# Altium schematic sheet EEGV4.0.SchDoc
size A2
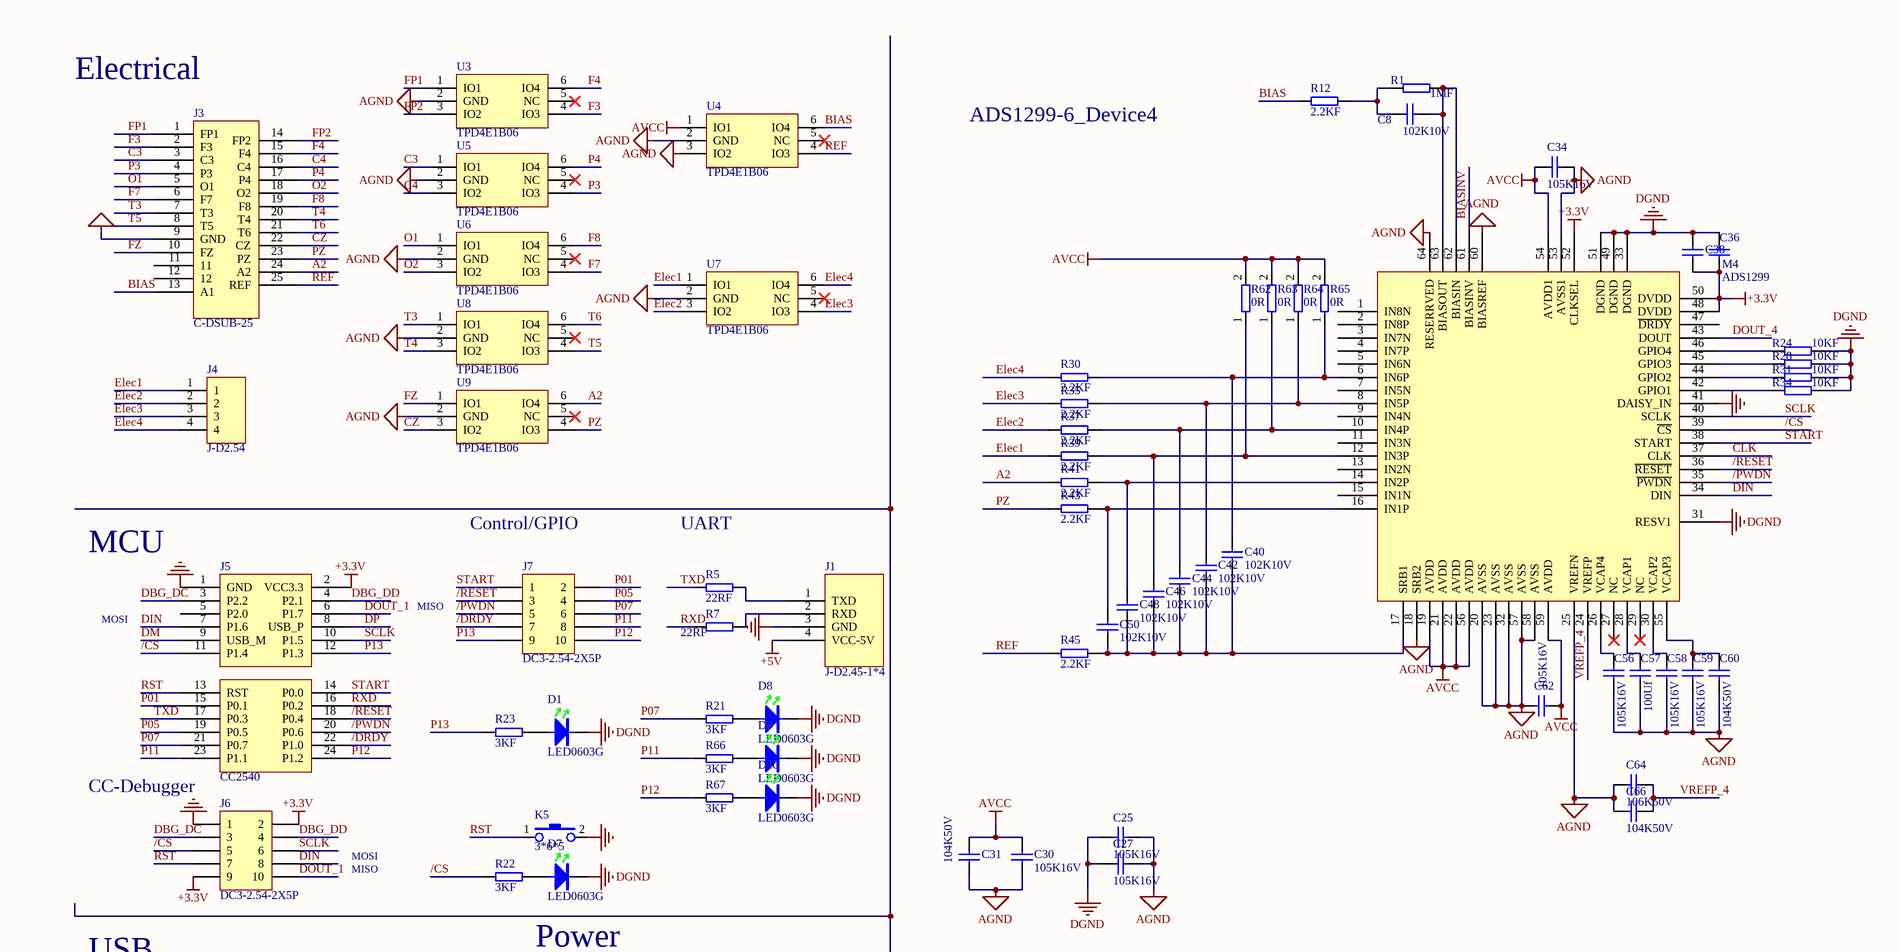
[diagram p0: EEGV4.0.SchDoc, top left]
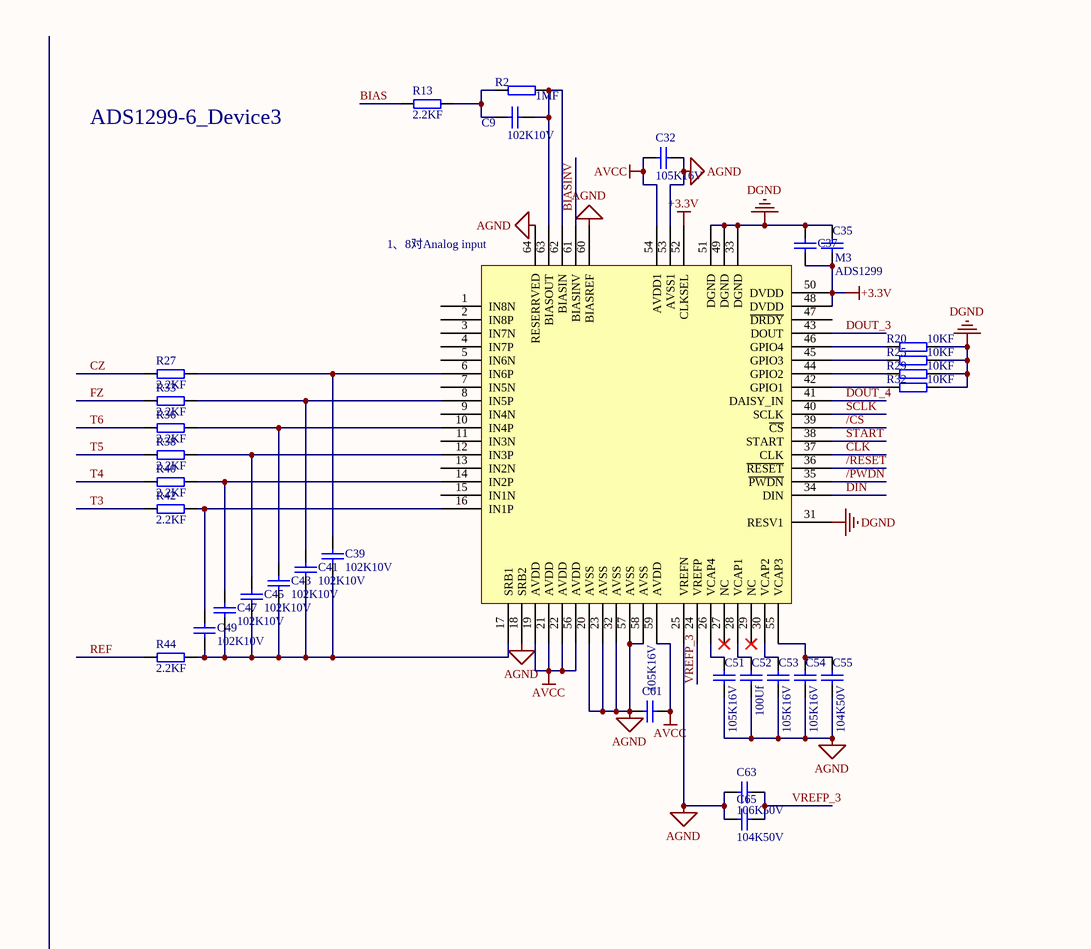
[diagram p1: EEGV4.0.SchDoc, top right]
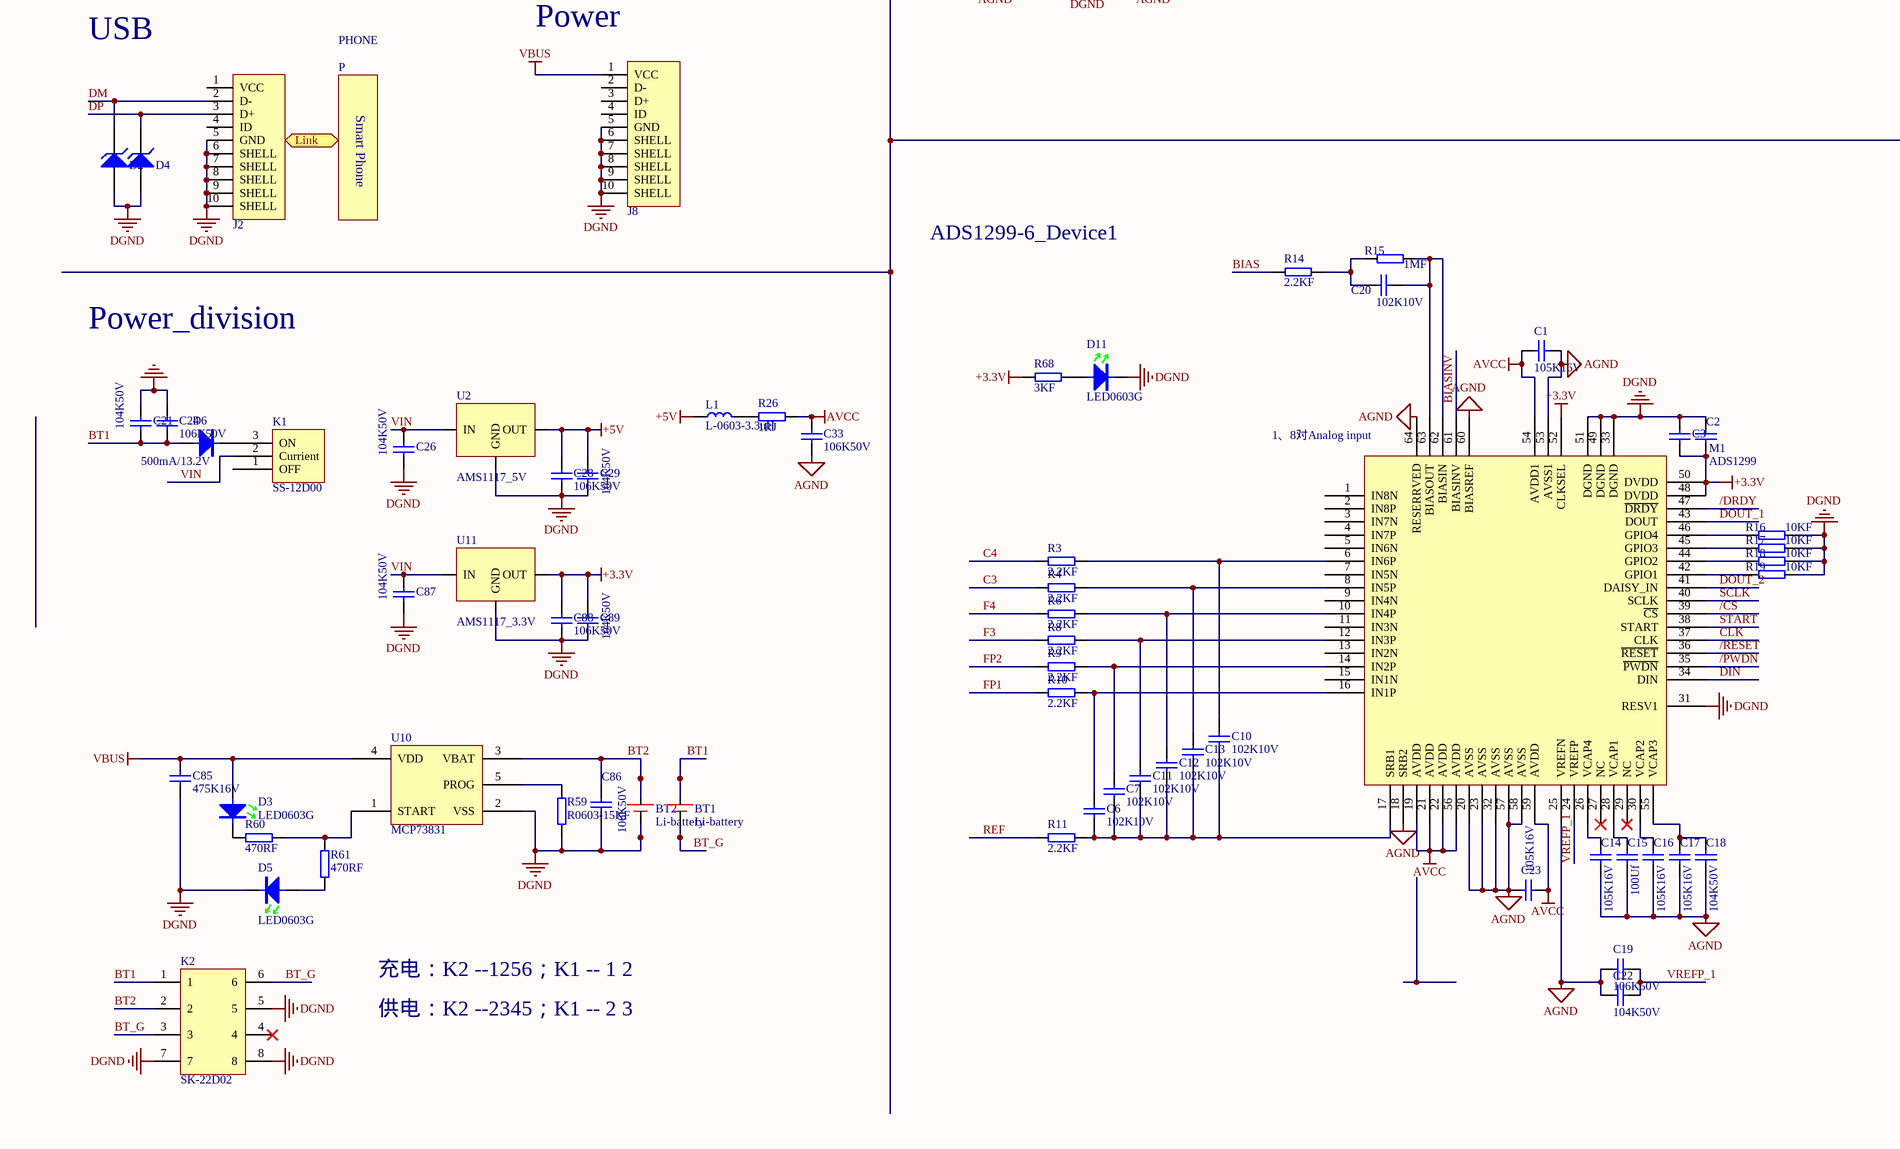
[diagram p2: EEGV4.0.SchDoc, bottom left]
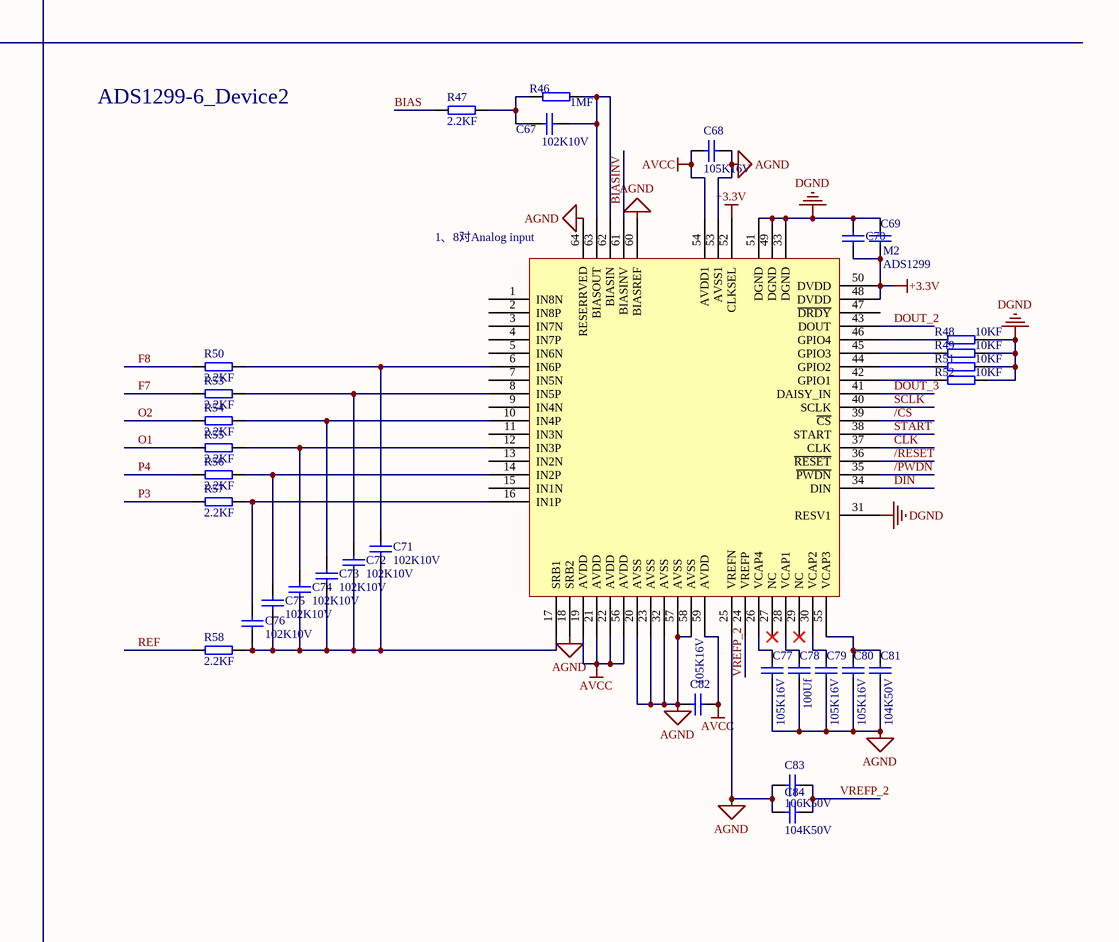
[diagram p3: EEGV4.0.SchDoc, bottom right]

## Parts
BT1  Li-battery  [LIR2032]
BT2  Li-battery  [LIR2032]
C1  105K16V  [C0603]
C2  104K50V  [C0603]  (value not drawn)
C3  105K16V  [C0603]  (value not drawn)
C6  102K10V  [C0603]
C7  102K10V  [C0603]
C8  102K10V  [C0603]
C9  102K10V  [C0603]
C10  102K10V  [C0603]
C11  102K10V  [C0603]
C12  102K10V  [C0603]
C13  102K10V  [C0603]
C14  105K16V  [C0603]
C15  100Uf  [C1210]
C16  105K16V  [C0603]
C17  105K16V  [C0603]
C18  104K50V  [C0603]
C19  106K50V  [C0603]
C20  102K10V  [C0603]
C21  104K50V  [C0603]
C22  104K50V  [C0603]
C23  105K16V  [C0603]
C24  106K50V  [C0603]
C25  105K16V  [C0603]
C26  104K50V  [C0603]
C27  105K16V  [C0603]
C28  106K50V  [C0603]
C29  104K50V  [C0603]
C30  105K16V  [C0603]
C31  104K50V  [C0603]
C32  105K16V  [C0603]
C33  106K50V  [C0603]
C34  105K16V  [C0603]
C35  104K50V  [C0603]  (value not drawn)
C36  104K50V  [C0603]  (value not drawn)
C37  105K16V  [C0603]  (value not drawn)
C38  105K16V  [C0603]  (value not drawn)
C39  102K10V  [C0603]
C40  102K10V  [C0603]
C41  102K10V  [C0603]
C42  102K10V  [C0603]
C43  102K10V  [C0603]
C44  102K10V  [C0603]
C45  102K10V  [C0603]
C46  102K10V  [C0603]
C47  102K10V  [C0603]
C48  102K10V  [C0603]
C49  102K10V  [C0603]
C50  102K10V  [C0603]
C51  105K16V  [C0603]
C52  100Uf  [C1210]
C53  105K16V  [C0603]
C54  105K16V  [C0603]
C55  104K50V  [C0603]
C56  105K16V  [C0603]
C57  100Uf  [C1210]
C58  105K16V  [C0603]
C59  105K16V  [C0603]
C60  104K50V  [C0603]
C61  105K16V  [C0603]
C62  105K16V  [C0603]
C63  106K50V  [C0603]
C64  106K50V  [C0603]
C65  104K50V  [C0603]
C66  104K50V  [C0603]
C67  102K10V  [C0603]
C68  105K16V  [C0603]
C69  104K50V  [C0603]  (value not drawn)
C70  105K16V  [C0603]  (value not drawn)
C71  102K10V  [C0603]
C72  102K10V  [C0603]
C73  102K10V  [C0603]
C74  102K10V  [C0603]
C75  102K10V  [C0603]
C76  102K10V  [C0603]
C77  105K16V  [C0603]
C78  100Uf  [C1210]
C79  105K16V  [C0603]
C80  105K16V  [C0603]
C81  104K50V  [C0603]
C82  105K16V  [C0603]
C83  106K50V  [C0603]
C84  104K50V  [C0603]
C85  475K16V  [C0603]
C86  106K50V  [C0603]
C87  104K50V  [C0603]
C88  106K50V  [C0603]
C89  104K50V  [C0603]
D1  LED0603G  [D-LED0603G]
D2  ESDA_TR1/0603  [HS_0603D]  (value not drawn)
D3  LED0603G  [D-LED0603G]
D4  ESDA_TR1/0603  [HS_0603D]  (value not drawn)
D5  LED0603G  [D-LED0603G]
D6  500mA/13.2V  [D1206]
D7  LED0603G  [D-LED0603G]
D8  LED0603G  [D-LED0603G]
D9  LED0603G  [D-LED0603G]
D10  LED0603G  [D-LED0603G]
D11  LED0603G  [D-LED0603G]
J1  J-D2.45-1*4  [D2.54-1*4P]
J2  USB-MINI-SOCKET  [MICRO-USB - 5.9]  (value not drawn)
J3  C-DSUB-25  [C-DSUB-25]
J4  J-D2.54  [D2.54-1*4P]
J5  CC2540  [CC2540]
J6  DC3-2.54-2X5P  [DC3-2.54-2X5P]
J7  DC3-2.54-2X5P  [DC3-2.54-2X5P]
J8  USB-MINI-SOCKET  [MICRO-USB - 5.9]  (value not drawn)
K1  SS-12D00  [SS-12D00]
K2  SK-22D02  [SK-22D02]
K5  3*6*5  [S-K3*6]
L1  L-0603-3.3uH  [L0603]
M1  ADS1299  [ADS1299-TSQFP50P1200X1200X105-64N]
M2  ADS1299  [ADS1299-TSQFP50P1200X1200X105-64N]
M3  ADS1299  [ADS1299-TSQFP50P1200X1200X105-64N]
M4  ADS1299  [ADS1299-TSQFP50P1200X1200X105-64N]
P  PHONE
R1  1MF  [R0603]
R2  1MF  [R0603]
R3  2.2KF  [R0603]
R4  2.2KF  [R0603]
R5  22RF  [R0603]
R6  2.2KF  [R0603]
R7  22RF  [R0603]
R8  2.2KF  [R0603]
R9  2.2KF  [R0603]
R10  2.2KF  [R0603]
R11  2.2KF  [R0603]
R12  2.2KF  [R0603]
R13  2.2KF  [R0603]
R14  2.2KF  [R0603]
R15  1MF  [R0603]
R16  10KF  [R0603]
R17  10KF  [R0603]
R18  10KF  [R0603]
R19  10KF  [R0603]
R20  10KF  [R0603]
R21  3KF  [R0603]
R22  3KF  [R0603]
R23  3KF  [R0603]
R24  10KF  [R0603]
R25  10KF  [R0603]
R26  1RJ  [R0603]
R27  2.2KF  [R0603]
R28  10KF  [R0603]
R29  10KF  [R0603]
R30  2.2KF  [R0603]
R31  10KF  [R0603]
R32  10KF  [R0603]
R33  2.2KF  [R0603]
R34  10KF  [R0603]
R35  2.2KF  [R0603]
R36  2.2KF  [R0603]
R37  2.2KF  [R0603]
R38  2.2KF  [R0603]
R39  2.2KF  [R0603]
R40  2.2KF  [R0603]
R41  2.2KF  [R0603]
R42  2.2KF  [R0603]
R43  2.2KF  [R0603]
R44  2.2KF  [R0603]
R45  2.2KF  [R0603]
R46  1MF  [R0603]
R47  2.2KF  [R0603]
R48  10KF  [R0603]
R49  10KF  [R0603]
R50  2.2KF  [R0603]
R51  10KF  [R0603]
R52  10KF  [R0603]
R53  2.2KF  [R0603]
R54  2.2KF  [R0603]
R55  2.2KF  [R0603]
R56  2.2KF  [R0603]
R57  2.2KF  [R0603]
R58  2.2KF  [R0603]
R59  R0603-15KF  [R0603]
R60  470RF  [R0603]
R61  470RF  [R0603]
R62  0R  [R0603]
R63  0R  [R0603]
R64  0R  [R0603]
R65  0R  [R0603]
R66  3KF  [R0603]
R67  3KF  [R0603]
R68  3KF  [R0603]
U2  AMS1117_5V  [SOT-223]
U3  TPD4E1B06  [U-ESD-DRL-SOTFL50P160X60-6N]
U4  TPD4E1B06  [U-ESD-DRL-SOTFL50P160X60-6N]
U5  TPD4E1B06  [U-ESD-DRL-SOTFL50P160X60-6N]
U6  TPD4E1B06  [U-ESD-DRL-SOTFL50P160X60-6N]
U7  TPD4E1B06  [U-ESD-DRL-SOTFL50P160X60-6N]
U8  TPD4E1B06  [U-ESD-DRL-SOTFL50P160X60-6N]
U9  TPD4E1B06  [U-ESD-DRL-SOTFL50P160X60-6N]
U10  MCP73831  [SOT23-5N]
U11  AMS1117_3.3V  [SOT-223]

## Ports
Link

## Nets
+3.3V: C2.1 C3.1 C35.1 C36.1 C37.1 C38.1 C69.1 C70.1 C88.2 C89.1 J5.2(VCC3.3) J6.2 J6.9 M1.48(DVDD) M1.50(DVDD) M1.52(CLKSEL) M2.48(DVDD) M2.50(DVDD) M2.52(CLKSEL) M3.48(DVDD) M3.50(DVDD) M3.52(CLKSEL) M4.48(DVDD) M4.50(DVDD) M4.52(CLKSEL) R68.1 U11.2(OUT)
+5V: C28.2 C29.1 J1.4(VCC-5V) L1.1 U2.2(OUT)
AGND: C1.1 C14.2 C15.2 C16.2 C17.2 C18.1 C19.2 C22.2 C23.2 C25.2 C27.2 C30.2 C31.2 C32.1 C33.1 C34.1 C51.2 C52.2 C53.2 C54.2 C55.1 C56.2 C57.2 C58.2 C59.2 C60.1 C61.2 C62.2 C63.2 C64.2 C65.2 C66.2 C68.1 C77.2 C78.2 C79.2 C80.2 C81.1 C82.2 C83.2 C84.2 J3.9(GND) M1.18(SRB2) M1.20(AVSS) M1.23(AVSS) M1.25(VREFN) M1.32(AVSS) M1.53(AVSS1) M1.57(AVSS) M1.58(AVSS) M1.60(BIASREF) M1.64(RESERRVED) M2.18(SRB2) M2.20(AVSS) M2.23(AVSS) M2.25(VREFN) M2.32(AVSS) M2.53(AVSS1) M2.57(AVSS) M2.58(AVSS) M2.60(BIASREF) M2.64(RESERRVED) M3.18(SRB2) M3.20(AVSS) M3.23(AVSS) M3.25(VREFN) M3.32(AVSS) M3.53(AVSS1) M3.57(AVSS) M3.58(AVSS) M3.60(BIASREF) M3.64(RESERRVED) M4.18(SRB2) M4.20(AVSS) M4.23(AVSS) M4.25(VREFN) M4.32(AVSS) M4.53(AVSS1) M4.57(AVSS) M4.58(AVSS) M4.60(BIASREF) M4.64(RESERRVED) U3.2(GND) U4.2(GND) U4.3(IO2) U5.2(GND) U6.2(GND) U7.2(GND) U8.2(GND) U9.2(GND)
AVCC: C1.2 C23.1 C30.1 C31.1 C32.2 C33.2 C34.2 C61.1 C62.1 C68.2 C82.1 M1.19(AVDD) M1.21(AVDD) M1.22(AVDD) M1.54(AVDD1) M1.56(AVDD) M1.59(AVDD) M2.19(AVDD) M2.21(AVDD) M2.22(AVDD) M2.54(AVDD1) M2.56(AVDD) M2.59(AVDD) M3.19(AVDD) M3.21(AVDD) M3.22(AVDD) M3.54(AVDD1) M3.56(AVDD) M3.59(AVDD) M4.19(AVDD) M4.21(AVDD) M4.22(AVDD) M4.54(AVDD1) M4.56(AVDD) M4.59(AVDD) R26.1 R62.2 R63.2 R64.2 R65.2 U4.1(IO1)
DGND: BT2.2 C2.2 C3.2 C21.1 C24.2 C25.1 C26.2 C27.1 C28.1 C29.2 C35.2 C36.2 C37.2 C38.2 C69.2 C70.2 C85.2 C86.2 C87.2 C88.1 C89.2 D1.2 D2.1(A) D4.1(A) D5.2 D7.2 D8.2 D9.2 D10.2 D11.2 J1.3(GND) J2.5(GND) J2.6(SHELL) J2.7(SHELL) J2.8(SHELL) J2.9(SHELL) J2.10(SHELL) J5.1(GND) J6.1 J8.5(GND) J8.6(SHELL) J8.7(SHELL) J8.8(SHELL) J8.9(SHELL) J8.10(SHELL) K2.5 K2.7 K2.8 K5.2 M1.31(RESV1) M1.33(DGND) M1.49(DGND) M1.51(DGND) M2.31(RESV1) M2.33(DGND) M2.49(DGND) M2.51(DGND) M3.31(RESV1) M3.33(DGND) M3.49(DGND) M3.51(DGND) M4.31(RESV1) M4.33(DGND) M4.41(DAISY_IN) M4.49(DGND) M4.51(DGND) R16.2 R17.2 R18.2 R19.2 R20.2 R24.2 R25.2 R28.2 R29.2 R31.2 R32.2 R34.2 R48.2 R49.2 R51.2 R52.2 R59.1 U2.1(GND) U10.2(VSS) U11.1(GND)
VBUS: C85.1 D3.1 J8.1(VCC) U10.4(VDD)
/CS: J5.11(P1.4) J6.5 M1.39(~{CS}) M2.39(~{CS}) M3.39(~{CS}) M4.39(~{CS}) R22.1
/DRDY: J5.22(P1.0) J7.7 M1.47(~{DRDY})
/PWDN: J5.20(P0.6) J7.5 M1.35(~{PWDN}) M2.35(~{PWDN}) M3.35(~{PWDN}) M4.35(~{PWDN})
/RESET: J5.18(P0.4) J7.3 M1.36(~{RESET}) M2.36(~{RESET}) M3.36(~{RESET}) M4.36(~{RESET})
A2: J3.24(A2) R41.1 U9.6(IO4)
BIAS: J3.13(A1) R12.1 R13.1 R14.1 R47.1 U4.6(IO4)
BIASINV: M1.61(BIASINV) M2.61(BIASINV) M3.61(BIASINV) M4.61(BIASINV)
BT1: BT1.1 C21.2 C24.1 D6.1 K2.1
BT2: BT2.1 C86.1 K2.2 U10.3(VBAT)
BT_G: BT1.2 K2.3 K2.6
C3: J3.3(C3) R4.1 U5.1(IO1)
C4: J3.16(C4) R3.1 U5.3(IO2)
CLK: M1.37(CLK) M2.37(CLK) M3.37(CLK) M4.37(CLK)
CZ: J3.22(CZ) R27.1 U9.3(IO2)
DBG_DC: J5.3(P2.2) J6.3
DBG_DD: J5.4(P2.1) J6.4
DIN: J5.7(P1.6) J6.8 M1.34(DIN) M2.34(DIN) M3.34(DIN) M4.34(DIN)
DM: D2.2(K) J2.2(D-) J5.9(USB_M)
DOUT_1: J5.6(P1.7) J6.10 M1.43(DOUT)
DOUT_2: M1.41(DAISY_IN) M2.43(DOUT)
DOUT_3: M2.41(DAISY_IN) M3.43(DOUT)
DOUT_4: M3.41(DAISY_IN) M4.43(DOUT)
DP: D4.2(K) J2.3(D+) J5.8(USB_P)
Elec1: J4.1 R39.1 U7.1(IO1)
Elec2: J4.2 R37.1 U7.3(IO2)
Elec3: J4.3 R35.1 U7.4(IO3)
Elec4: J4.4 R30.1 U7.6(IO4)
F3: J3.2(F3) R8.1 U3.4(IO3)
F4: J3.15(F4) R6.1 U3.6(IO4)
F7: J3.6(F7) R53.1 U6.4(IO3)
F8: J3.19(F8) R50.1 U6.6(IO4)
FP1: J3.1(FP1) R10.1 U3.1(IO1)
FP2: J3.14(FP2) R9.1 U3.3(IO2)
FZ: J3.10(FZ) R33.1 U9.1(IO1)
O1: J3.5(O1) R55.1 U6.1(IO1)
O2: J3.18(O2) R54.1 U6.3(IO2)
P01: J5.15(P0.1) J7.2
P3: J3.4(P3) R57.1 U5.4(IO3)
P4: J3.17(P4) R56.1 U5.6(IO4)
P05: J5.19(P0.5) J7.4
P07: J5.21(P0.7) J7.6 R21.1
P11: J5.23(P1.1) J7.8 R66.1
P12: J5.24(P1.2) J7.10 R67.1
P13: J5.12(P1.3) J7.9 R23.1
PZ: J3.23(PZ) R43.1 U9.4(IO3)
REF: J3.25(REF) R11.1 R44.1 R45.1 R58.1 U4.4(IO3)
RST: J5.13(RST) J6.7 K5.1
RXD: J5.16(P0.2) R7.2
SCLK: J5.10(P1.5) J6.6 M1.40(SCLK) M2.40(SCLK) M3.40(SCLK) M4.40(SCLK)
START: J5.14(P0.0) J7.1 M1.38(START) M2.38(START) M3.38(START) M4.38(START)
T3: J3.7(T3) R42.1 U8.1(IO1)
T4: J3.20(T4) R40.1 U8.3(IO2)
T5: J3.8(T5) R38.1 U8.4(IO3)
T6: J3.21(T6) R36.1 U8.6(IO4)
TXD: J5.17(P0.3) R5.2
VIN: C26.1 C87.1 K1.2(Currient) U2.3(IN) U11.3(IN)
VREFP_1: C19.1 C22.1 M1.24(VREFP)
VREFP_2: C83.1 C84.1 M2.24(VREFP)
VREFP_3: C63.1 C65.1 M3.24(VREFP)
VREFP_4: C64.1 C66.1 M4.24(VREFP)
NetC6_1: C6.1 M1.16(IN1P) R10.2
NetC6_2: C6.2 C7.2 C10.2 C11.2 C12.2 C13.2 M1.17(SRB1) R11.2
NetC7_1: C7.1 M1.14(IN2P) R9.2
NetC8_1: C8.1 M4.62(BIASIN) M4.63(BIASOUT) R1.2
NetC8_2: C8.2 R1.1 R12.2
NetC9_1: C9.1 M3.62(BIASIN) M3.63(BIASOUT) R2.2
NetC9_2: C9.2 R2.1 R13.2
NetC10_1: C10.1 M1.6(IN6P) R3.2
NetC11_1: C11.1 M1.12(IN3P) R8.2
NetC12_1: C12.1 M1.10(IN4P) R6.2
NetC13_1: C13.1 M1.8(IN5P) R4.2
NetC14_1: C14.1 M1.26(VCAP4)
NetC15_1: C15.1 M1.28(VCAP1)
NetC16_1: C16.1 M1.30(VCAP2)
NetC17_1: C17.1 C18.2 M1.55(VCAP3)
NetC20_1: C20.1 M1.62(BIASIN) M1.63(BIASOUT) R15.2
NetC20_2: C20.2 R14.2 R15.1
NetC39_1: C39.1 M3.6(IN6P) R27.2
NetC39_2: C39.2 C41.2 C43.2 C45.2 C47.2 C49.2 M3.17(SRB1) R44.2
NetC40_1: C40.1 M4.6(IN6P) R30.2 R65.1
NetC40_2: C40.2 C42.2 C44.2 C46.2 C48.2 C50.2 M4.17(SRB1) R45.2
NetC41_1: C41.1 M3.8(IN5P) R33.2
NetC42_1: C42.1 M4.8(IN5P) R35.2 R64.1
NetC43_1: C43.1 M3.10(IN4P) R36.2
NetC44_1: C44.1 M4.10(IN4P) R37.2 R63.1
NetC45_1: C45.1 M3.12(IN3P) R38.2
NetC46_1: C46.1 M4.12(IN3P) R39.2 R62.1
NetC47_1: C47.1 M3.14(IN2P) R40.2
NetC48_1: C48.1 M4.14(IN2P) R41.2
NetC49_1: C49.1 M3.16(IN1P) R42.2
NetC50_1: C50.1 M4.16(IN1P) R43.2
NetC51_1: C51.1 M3.26(VCAP4)
NetC52_1: C52.1 M3.28(VCAP1)
NetC53_1: C53.1 M3.30(VCAP2)
NetC54_1: C54.1 C55.2 M3.55(VCAP3)
NetC56_1: C56.1 M4.26(VCAP4)
NetC57_1: C57.1 M4.28(VCAP1)
NetC58_1: C58.1 M4.30(VCAP2)
NetC59_1: C59.1 C60.2 M4.55(VCAP3)
NetC67_1: C67.1 M2.62(BIASIN) M2.63(BIASOUT) R46.2
NetC67_2: C67.2 R46.1 R47.2
NetC71_1: C71.1 M2.6(IN6P) R50.2
NetC71_2: C71.2 C72.2 C73.2 C74.2 C75.2 C76.2 M2.17(SRB1) R58.2
NetC72_1: C72.1 M2.8(IN5P) R53.2
NetC73_1: C73.1 M2.10(IN4P) R54.2
NetC74_1: C74.1 M2.12(IN3P) R55.2
NetC75_1: C75.1 M2.14(IN2P) R56.2
NetC76_1: C76.1 M2.16(IN1P) R57.2
NetC77_1: C77.1 M2.26(VCAP4)
NetC78_1: C78.1 M2.28(VCAP1)
NetC79_1: C79.1 M2.30(VCAP2)
NetC80_1: C80.1 C81.2 M2.55(VCAP3)
NetD1_1: D1.1 R23.2
NetD3_2: D3.2 R60.1
NetD5_1: D5.1 R61.1
NetD6_2: D6.2 K1.3(ON)
NetD7_1: D7.1 R22.2
NetD8_1: D8.1 R21.2
NetD9_1: D9.1 R66.2
NetD10_1: D10.1 R67.2
NetD11_1: D11.1 R68.2
NetJ1_1: J1.1(TXD) R5.1
NetJ1_2: J1.2(RXD) R7.1
NetL1_2: L1.2 R26.2
NetM1_42: M1.42(GPIO1) R19.1
NetM1_44: M1.44(GPIO2) R18.1
NetM1_45: M1.45(GPIO3) R17.1
NetM1_46: M1.46(GPIO4) R16.1
NetM2_42: M2.42(GPIO1) R52.1
NetM2_44: M2.44(GPIO2) R51.1
NetM2_45: M2.45(GPIO3) R49.1
NetM2_46: M2.46(GPIO4) R48.1
NetM3_42: M3.42(GPIO1) R32.1
NetM3_44: M3.44(GPIO2) R29.1
NetM3_45: M3.45(GPIO3) R25.1
NetM3_46: M3.46(GPIO4) R20.1
NetM4_42: M4.42(GPIO1) R34.1
NetM4_44: M4.44(GPIO2) R31.1
NetM4_45: M4.45(GPIO3) R28.1
NetM4_46: M4.46(GPIO4) R24.1
NetR59_2: R59.2 U10.5(PROG)
NetR60_2: R60.2 R61.2 U10.1(START)

Not connected (* = marked no-connect by the designer): J2 1(VCC) 4(ID); J3 11 12; J5 5(P2.0); J8 2(D-) 3(D+) 4(ID); K1 1(OFF); K2 4*; M1 1(IN8N) 2(IN8P) 3(IN7N) 4(IN7P) 5(IN6N) 7(IN5N) 9(IN4N) 11(IN3N) 13(IN2N) 15(IN1N) 27(NC)* 29(NC)*; M2 1(IN8N) 2(IN8P) 3(IN7N) 4(IN7P) 5(IN6N) 7(IN5N) 9(IN4N) 11(IN3N) 13(IN2N) 15(IN1N) 27(NC)* 29(NC)* 47(~{DRDY}); M3 1(IN8N) 2(IN8P) 3(IN7N) 4(IN7P) 5(IN6N) 7(IN5N) 9(IN4N) 11(IN3N) 13(IN2N) 15(IN1N) 27(NC)* 29(NC)* 47(~{DRDY}); M4 1(IN8N) 2(IN8P) 3(IN7N) 4(IN7P) 5(IN6N) 7(IN5N) 9(IN4N) 11(IN3N) 13(IN2N) 15(IN1N) 27(NC)* 29(NC)* 47(~{DRDY}); U3 5(NC)*; U4 5(NC)*; U5 5(NC)*; U6 5(NC)*; U7 5(NC)*; U8 5(NC)*; U9 5(NC)*

## Notes on the sheet
- (near J3) Electrical
- ADS1299-6_Device4
- ADS1299-6_Device3
- (near M3) 1、8对Analog input
- MCU
- Control/GPIO
- UART
- MOSI
- MISO
- CC-Debugger
- USB
- Power
- ADS1299-6_Device1
- ADS1299-6_Device2
- Power_division
- (near M2) 1、8对Analog input
- (near M1) 1、8对Analog input
- 充电：K2 --1256；K1 -- 1 2
- 供电：K2 --2345；K1 -- 2 3
- (in symbol PHONE) Smart Phone

## Library data of the parts
BT1 BT2 = Li-batttery: 纽扣电池LIR2023
C1 C3 C14 C16 C17 C23 C25 C27 C30 C32 C34 C37 C38 C51 C53 C54 C56 C58 C59 C61 C62 C68 C70 C77 C79 C80 C82 = C0603X7R-105K16V: 贴片电容-陶瓷; 规格型号: 1uF±10%_16V_X7R_C0603; 生产商: 风华 三星; 供应商: *; 备注: *
C2 C18 C21 C22 C26 C29 C31 C35 C36 C55 C60 C65 C66 C69 C81 C84 C87 C89 = C0603X7R-104K50V: 贴片电容-陶瓷; 规格型号: 100nF±10%_50V_X7R_C0603; 生产商: 风华 三星; 供应商: *; 备注: *
C6-C13 C20 C39-C50 C67 C71-C76 = C0603X7R-102K10V: 贴片电容-陶瓷
C15 C52 C57 C78 = C1210钽电容 --100UF--B3528: C1210-100UF
C19 C24 C28 C33 C63 C64 C83 C86 C88 = C0603X7R-106K50V: 贴片电容-陶瓷; 规格型号: 10uF±10%_50V_X7R_C0603; 生产商: 风华 三星; 供应商: *; 备注: *
C85 = C0603X7R-475K16V: 贴片电容-陶瓷; 规格型号: 4.7uF±10%_16V_X7R_C0603; 生产商: 风华 三星; 供应商: *; 备注: *
D1 D3 D5 D7-D11 = DLED-0603-G: 贴片二极管-LED; 规格型号: 0603-GREEN; 货品编码: 无样品无编码; 生产商: *; 供应商: *; 备注: *
D2 D4 = D Zener: Zener Diode; Published: *; LatestRevisionDate: *; LatestRevisionNote: *; PackageReference: *; Publisher: *
D6 = 1206MSD: 500mA/13.2V 自恢复保险丝
J1 = J-D2.54-1*4单排排母
J2 J8 = J-USB-MINI-SOCKET: USB-A卧式插座; 供应商: *; 备注: *
J3 = C-DSUB-25: C-DSUB-0064
J4 = J-D2.54-1*4-单排: 单排排针
J5 = CC2540: 蓝牙主控模块的接口
J6 J7 = J-DC3-2.54-2X5P: 简牛插座-直针; 规格型号: 间距2.54 DC3 双排5P 简牛插座-直针; 货品编码: 371064; 生产商: 欧朗电子; 供应商: 欧朗电子; 备注: *
K1 = SS-12D00(1P2T) 立式 柄高5MM
K2 = SK-22D02: 波动开关-2档6脚
K5 = 3*6*5: 贴片-卧式轻触开关
L1 = L-0603-3.3uH: 贴片电感-屏蔽; 生产商: *; 供应商: *; 备注: *
M1-M4 = ADS1299: ADS1299-S-PQFP-64; ADS1299: S-PQFP-64
R1 R2 R15 R46 = R0603-1MF: 贴片电阻-通用; value: 1MF 0603贴片电阻-通用; 厂商: 10K±1%_1/10W_±200ppm_R0603 国巨
R3 R4 R6 R8-R14 R27 R30 R33 R35-R45 R47 R50 R53-R58 = R0603-2.2KF: 贴片电阻-通用; 生产商: 厚声 国巨; 规格型号: 2.2K±1%_1/10W_±200ppm_R0603; 货品编码: 无样品无编码; 备注: *; 供应商: *
R5 R7 = R0603-22RF: 贴片电阻-通用; 生产商: 厚声 国巨; 规格型号: 22R±5%_1/10W_±200ppm_R0603; 货品编码: 无样品无编码; 备注: *; 供应商: *
R16-R20 R24 R25 R28 R29 R31 R32 R34 R48 R49 R51 R52 = R0603-10KF: 贴片电阻-通用; 生产商: 厚声 国巨; 规格型号: 10K±1%_1/10W_±200ppm_R0603; 备注: *; 供应商: *
R21-R23 R66-R68 = R0603-3KF: 贴片电阻-通用; 生产商: 厚声 国巨; 规格型号: 3K±1%_1/10W_±200ppm_R0603; 货品编码: 无样品无编码; 备注: *; 供应商: *
R26 = R0603-1RJ: 贴片电阻-通用; 生产商: 厚声 国巨; 规格型号: 1R±5%_1/10W_±200ppm_R0603; 货品编码: 无样品无编码; 备注: *; 供应商: *
R59 = R0603-15KF: 贴片电容-通用
R60 R61 = R0603-470RF: 贴片电阻-通用; 生产商: 厚声 国巨; 规格型号: 470R±1%_1/10W_±200ppm_R0603; 货品编码: 无样品无编码; 备注: *; 供应商: *
R62-R65 = R0603-0R: 贴片电阻-通用; 生产商: 厚声 国巨; 规格型号: 0R_1/10W_±200ppm_R0603; 货品编码: 无样品无编码; 备注: *; 供应商: *
U2 = AMS1117-5V
U3-U9 = U-TPD4E1B06: ESD-防静电干扰
U10 = MCP73831: charge IC
U11 = AMS1117-3.3V